# EAGLE design proxi (EAGLE 7.7.0)
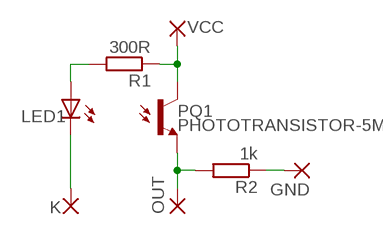
[diagram p0: schematic, sheet 1]

## Parts
GND  SMD2  [SMD1,27-2,54]
K  SMD2  [SMD1,27-2,54]
LED1  LED5MM  [LED5MM]
OUT  SMD2  [SMD1,27-2,54]
PQ1  PHOTOTRANSISTOR-5MM  [LED5MM]
R1  300R  R-EU_R0805  [R0805]
R2  1k  R-EU_R0805  [R0805]
VCC  SMD2  [SMD1,27-2,54]

## Nets
GND: GND.1(P) R2.1
N$1: K.1(P) LED1.K(C)
N$5: LED1.A R1.2
OUT: OUT.1(P) PQ1.A(E) R2.2
VCC: PQ1.K(C) R1.1 VCC.1(P)

## Library data of the parts
GND K OUT VCC = wirepad:SMD2: SMD PAD
LED1 = adafruit:LED: LED OSRAM: - CHIPLED LG R971, LG N971, LY N971, LG Q971, LY Q971, LO R971, LY R971 LH N974, LH R974 LS Q976, LO Q976, LY Q976 LO Q996 - Hyper CHIPLED LW Q18S LB Q993, LB Q99A, LB R99A - SideLED LS A670, LO A670, LY A670, LG A670, LP A670 LB A673, LV A673, LT A673, LW A673 LH A674 LY A675 LS A676, LA A676, LO A676, LY A676, LW A676 LS A679, LY A679, LG A679 - Hyper Micro SIDELED® LS Y876, LA Y876, LO Y876, LY Y876 LT Y87S - SmartLED LW L88C, LW L88S LB L89C, LB L89S, LG L890 LS L89K, LO L89K, LY L89K LS L896, LA L896, LO L896, LY L896 - TOPLED LS T670, LO T670, LY T670, LG T670, LP T670 LSG T670, LSP T670, LSY T670, LOP T670, LYG T670 LG T671, LOG T671, LSG T671 LB T673, LV T673, LT T673, LW T673 LH T674 LS T676, LA T676, LO T676, LY T676, LB T676, LH T676, LSB T676, LW T676 LB T67C, LV T67C, LT T67C, LS T67K, LO T67K, LY T67K, LW E67C LS E67B, LA E67B, LO E67B, LY E67B, LB E67C, LV E67C, LT E67C LW T67C LS T679, LY T679, LG T679 LS T770, LO T770, LY T770, LG T770, LP T770 LB T773, LV T773, LT T773, LW T773 LH T774 LS E675, LA E675, LY E675, LS T675 LS T776, LA T776, LO T776, LY T776, LB T776 LHGB T686 LT T68C, LB T68C - Hyper Mini TOPLED® LB M676 - Mini TOPLED Santana® LG M470 LS M47K, LO M47K, LY M47K Source: http://www.osram.convergy.de/
PQ1 = custom:PHOTOTRANSISTOR-5MM
R1 R2 = resistor:R-EU_: RESISTOR, European symbol

## Board
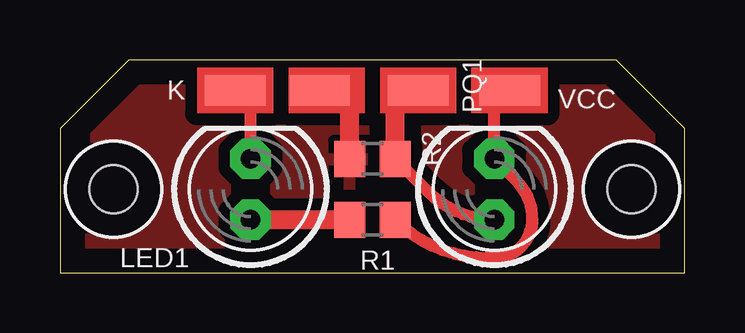
[diagram p1: board, top side]
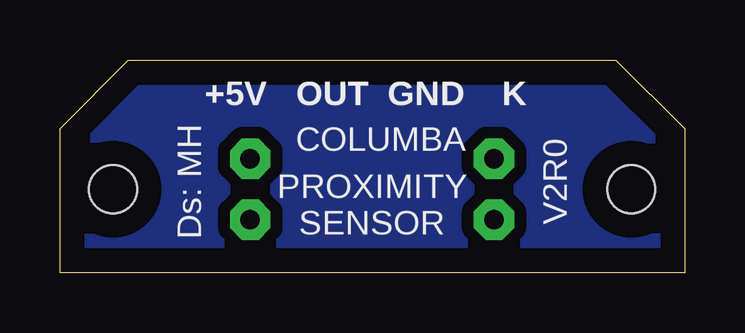
[diagram p2: board, bottom side, seen from below]

Size 26.02 x 8.89 mm. Coordinates in mm from the lower left corner, seen from the top.
Outline: 0,0 26.02,0 26.02,6.02 23.18,8.89 2.87,8.89 0,6.02 0,0
Copper layers (1*16): Top 0.035mm / dielectric 1.5mm / Bottom 0.035mm
Design rules "default": minimum track width 10mil, minimum drill 24mil, track to track 8mil, track to pad 8mil, pad to pad 8mil, via to via 8mil, smd to smd 8mil, copper to edge 40mil, drill to drill 8mil, minimum pad ring 10mil, minimum via ring 8mil, stop-mask expansion 4mil, vias tented up to drill 0mil, thermal gap 10mil
Holes 2 mm at 2.22,3.49 23.81,3.49

### Footprints (pad centres in the part's own frame; a part is rotated, then mirrored left to right if it is on the bottom)
SMD1,27-2,54 = smd 1.27 x 2.54: 1 0,0
LED5MM = drill 0.813 pad 1.676 octagon: A -1.27,0; K 1.27,0
R0805 = smd 1.3 x 1.5: 1 -0.95,0; 2 0.95,0

### Placement (x,y rotation side)
GND  10.79,7.62 90 top
K  7.3,7.62 270 top
LED1  7.94,3.49 90 top
OUT  14.92,7.62 90 top
PQ1  18.1,3.49 90 top
R1  13.02,2.22 180 top
R2  13.02,4.76 0 top
VCC  18.73,7.62 270 top

### Tracks (layer width: path | path; a pad name or v marks a point on that pad's centre or on a via)
GND
  Top 0.8: R2.1 12.07,7.61 arc45 12.06,7.62 GND.1
  pour Bottom (isolate 0.5): 0.64,6.03 0.64,0.64 25.4,0.64 25.4,6.03 23.18,8.26 2.86,8.26
  pour Top (isolate 0.5): 0.64,6.03 0.64,0.64 25.4,0.64 25.4,6.03 23.18,8.26 2.86,8.26
N$1
  Top 0.5: LED1.K 7.94,7.62 K.1
N$5
  Top 0.8: R1.2 LED1.A
OUT
  Top 0.5: PQ1.A arc-45 15.38,3.35 R2.2
  Top 0.8: R2.2 13.97,7.61 arc-45 13.97,7.62 OUT.1
VCC
  Top 0.5: VCC.1 18.1,7.62 PQ1.K 19.01,3.85 arc-45 19.68,2.22 arc-90 18.1,0.64 17.8,0.64 arc-45 R1.1
(copper drawn outside any net)
  shapes: Top area x4

### Text on the board
bNames: K | GND | OUT | +5V | COLUMBA | V2R0 | Ds: MH | PROXIMITY / SENSOR